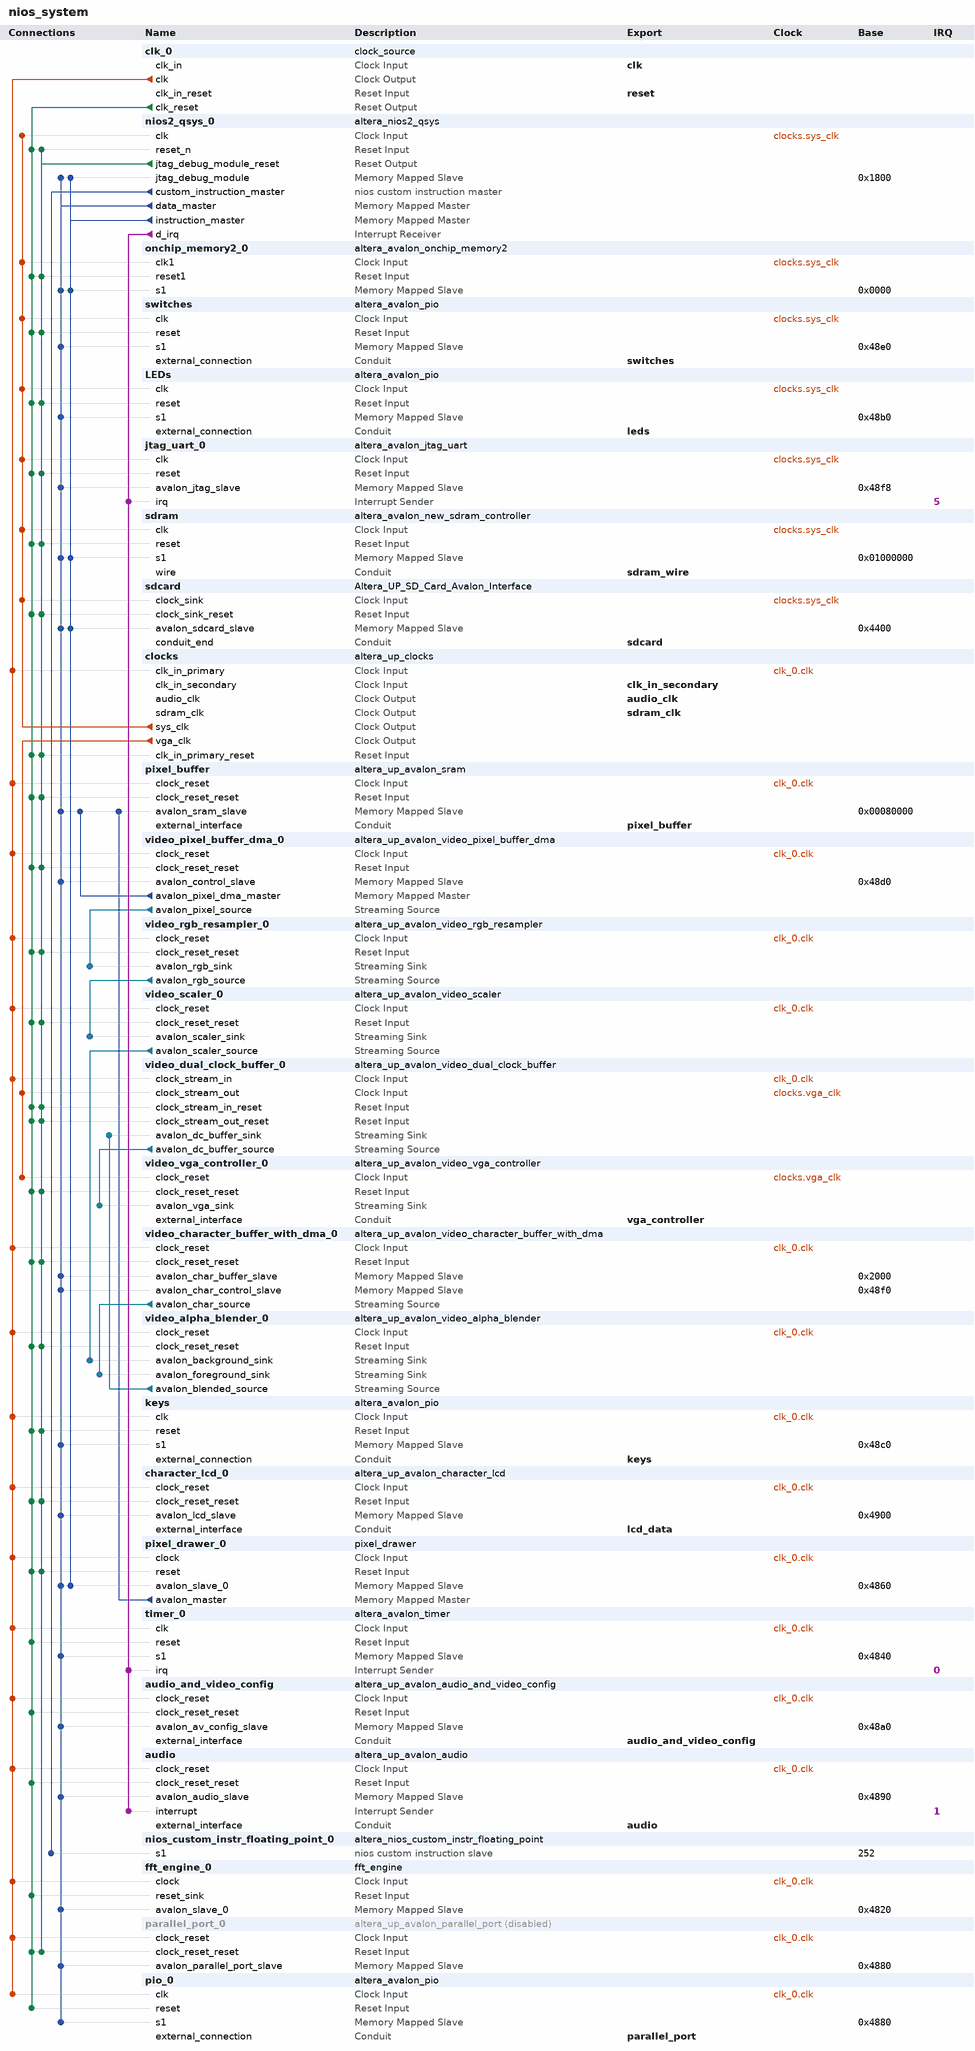
[diagram p0: system contents]
# Platform Designer (Qsys) system nios_system, Cyclone II EP2C35F672C6
# Parameters at their usual value, and those the tool derives, are not listed.
package require -exact qsys 13.0
create_system nios_system
set_project_property DEVICE_FAMILY {Cyclone II}
set_project_property DEVICE EP2C35F672C6

add_instance clk_0 clock_source 13.0
set_instance_parameter_value clk_0 clockFrequency 50000000

add_instance nios2_qsys_0 altera_nios2_qsys 13.0
set_instance_parameter_value nios2_qsys_0 muldiv_divider true
set_instance_parameter_value nios2_qsys_0 resetSlave sdram.s1
set_instance_parameter_value nios2_qsys_0 mmu_TLBMissExcSlave None
set_instance_parameter_value nios2_qsys_0 exceptionSlave sdram.s1
set_instance_parameter_value nios2_qsys_0 breakSlave nios2_qsys_0.jtag_debug_module
set_instance_parameter_value nios2_qsys_0 impl Fast
set_instance_parameter_value nios2_qsys_0 icache_size 4096

add_instance onchip_memory2_0 altera_avalon_onchip_memory2 13.0.1.99.2
set_instance_parameter_value onchip_memory2_0 dataWidth 32
set_instance_parameter_value onchip_memory2_0 dualPort false
set_instance_parameter_value onchip_memory2_0 initMemContent true
set_instance_parameter_value onchip_memory2_0 initializationFileName onchip_mem.hex
set_instance_parameter_value onchip_memory2_0 memorySize 4096

add_instance switches altera_avalon_pio 13.0.1.99.2
set_instance_parameter_value switches direction Input
set_instance_parameter_value switches width 15

add_instance LEDs altera_avalon_pio 13.0.1.99.2
set_instance_parameter_value LEDs direction Output
set_instance_parameter_value LEDs width 8

add_instance jtag_uart_0 altera_avalon_jtag_uart 13.0.1.99.2
set_instance_parameter_value jtag_uart_0 simInteractiveOptions NO_INTERACTIVE_WINDOWS

add_instance sdram altera_avalon_new_sdram_controller 13.0.1.99.2
set_instance_parameter_value sdram TAC 5.5
set_instance_parameter_value sdram TRCD 20.0
set_instance_parameter_value sdram TRP 20.0
set_instance_parameter_value sdram casLatency 3
set_instance_parameter_value sdram columnWidth 8
set_instance_parameter_value sdram dataWidth 16
set_instance_parameter_value sdram generateSimulationModel false
set_instance_parameter_value sdram model single_Micron_MT48LC4M32B2_7_chip
set_instance_parameter_value sdram numberOfBanks 4
set_instance_parameter_value sdram numberOfChipSelects 1
set_instance_parameter_value sdram powerUpDelay 100.0
set_instance_parameter_value sdram refreshPeriod 15.625
set_instance_parameter_value sdram rowWidth 12

add_instance sdcard Altera_UP_SD_Card_Avalon_Interface 13.0

add_instance clocks altera_up_clocks 13.0
set_instance_parameter_value clocks board DE2
set_instance_parameter_value clocks vga_clk true
set_instance_parameter_value clocks audio_clk true
set_instance_parameter_value clocks audio_clk_freq 12.288

add_instance pixel_buffer altera_up_avalon_sram 13.0
set_instance_parameter_value pixel_buffer board DE2
set_instance_parameter_value pixel_buffer pixel_buffer true

add_instance video_pixel_buffer_dma_0 altera_up_avalon_video_pixel_buffer_dma 13.0
set_instance_parameter_value video_pixel_buffer_dma_0 addr_mode X-Y
set_instance_parameter_value video_pixel_buffer_dma_0 start_address 0
set_instance_parameter_value video_pixel_buffer_dma_0 back_start_address 0
set_instance_parameter_value video_pixel_buffer_dma_0 image_width 320
set_instance_parameter_value video_pixel_buffer_dma_0 image_height 240
set_instance_parameter_value video_pixel_buffer_dma_0 color_space {16-bit RGB}

add_instance video_rgb_resampler_0 altera_up_avalon_video_rgb_resampler 13.0
set_instance_parameter_value video_rgb_resampler_0 input_type {16-bit RGB}
set_instance_parameter_value video_rgb_resampler_0 output_type {30-bit RGB}
set_instance_parameter_value video_rgb_resampler_0 alpha 1023

add_instance video_scaler_0 altera_up_avalon_video_scaler 13.0
set_instance_parameter_value video_scaler_0 width_scaling 2
set_instance_parameter_value video_scaler_0 height_scaling 2
set_instance_parameter_value video_scaler_0 width_in 320
set_instance_parameter_value video_scaler_0 color_bits 10
set_instance_parameter_value video_scaler_0 color_planes 3

add_instance video_dual_clock_buffer_0 altera_up_avalon_video_dual_clock_buffer 13.0
set_instance_parameter_value video_dual_clock_buffer_0 color_bits 10

add_instance video_vga_controller_0 altera_up_avalon_video_vga_controller 13.0
set_instance_parameter_value video_vga_controller_0 board DE2

add_instance video_character_buffer_with_dma_0 altera_up_avalon_video_character_buffer_with_dma 13.0
set_instance_parameter_value video_character_buffer_with_dma_0 enable_transparency true

add_instance video_alpha_blender_0 altera_up_avalon_video_alpha_blender 13.0

add_instance keys altera_avalon_pio 13.0.1.99.2
set_instance_parameter_value keys direction Input
set_instance_parameter_value keys width 3

add_instance character_lcd_0 altera_up_avalon_character_lcd 13.0
set_instance_parameter_value character_lcd_0 cursor Normal

add_instance pixel_drawer_0 pixel_drawer 1.0
set_instance_parameter_value pixel_drawer_0 pixel_buffer_base 524288

add_instance timer_0 altera_avalon_timer 13.0.1.99.2
set_instance_parameter_value timer_0 period 1
set_instance_parameter_value timer_0 periodUnits MSEC

add_instance audio_and_video_config altera_up_avalon_audio_and_video_config 13.0
set_instance_parameter_value audio_and_video_config board DE2
set_instance_parameter_value audio_and_video_config audio_in {Microphone to ADC}
set_instance_parameter_value audio_and_video_config line_in_bypass false
set_instance_parameter_value audio_and_video_config bit_length 16
set_instance_parameter_value audio_and_video_config sampling_rate {32 kHz}

add_instance audio altera_up_avalon_audio 13.0
set_instance_parameter_value audio avalon_bus_type {Memory Mapped}
set_instance_parameter_value audio audio_in true
set_instance_parameter_value audio dw 16

add_instance nios_custom_instr_floating_point_0 altera_nios_custom_instr_floating_point 13.0

add_instance fft_engine_0 fft_engine 1.0

add_instance parallel_port_0 altera_up_avalon_parallel_port 13.0
set_instance_property parallel_port_0 ENABLED false
set_instance_parameter_value parallel_port_0 board DE2
set_instance_parameter_value parallel_port_0 preset {Expansion Header}
set_instance_parameter_value parallel_port_0 capture false
set_instance_parameter_value parallel_port_0 edge Rising
set_instance_parameter_value parallel_port_0 irq false

add_instance pio_0 altera_avalon_pio 13.0.1.99.2
set_instance_parameter_value pio_0 direction Bidir
set_instance_parameter_value pio_0 width 15

# connections
add_connection clk_0.clk audio.clock_reset clock
add_connection clk_0.clk audio_and_video_config.clock_reset clock
add_connection clk_0.clk character_lcd_0.clock_reset clock
add_connection clk_0.clk clocks.clk_in_primary clock
add_connection clk_0.clk fft_engine_0.clock clock
add_connection clk_0.clk keys.clk clock
add_connection clk_0.clk parallel_port_0.clock_reset clock
add_connection clk_0.clk pio_0.clk clock
add_connection clk_0.clk pixel_buffer.clock_reset clock
add_connection clk_0.clk pixel_drawer_0.clock clock
add_connection clk_0.clk timer_0.clk clock
add_connection clk_0.clk video_alpha_blender_0.clock_reset clock
add_connection clk_0.clk video_character_buffer_with_dma_0.clock_reset clock
add_connection clk_0.clk video_dual_clock_buffer_0.clock_stream_in clock
add_connection clk_0.clk video_pixel_buffer_dma_0.clock_reset clock
add_connection clk_0.clk video_rgb_resampler_0.clock_reset clock
add_connection clk_0.clk video_scaler_0.clock_reset clock
add_connection clocks.sys_clk jtag_uart_0.clk clock
add_connection clocks.sys_clk LEDs.clk clock
add_connection clocks.sys_clk nios2_qsys_0.clk clock
add_connection clocks.sys_clk onchip_memory2_0.clk1 clock
add_connection clocks.sys_clk sdcard.clock_sink clock
add_connection clocks.sys_clk sdram.clk clock
add_connection clocks.sys_clk switches.clk clock
add_connection clocks.vga_clk video_dual_clock_buffer_0.clock_stream_out clock
add_connection clocks.vga_clk video_vga_controller_0.clock_reset clock
add_connection clk_0.clk_reset audio.clock_reset_reset reset
add_connection clk_0.clk_reset audio_and_video_config.clock_reset_reset reset
add_connection clk_0.clk_reset character_lcd_0.clock_reset_reset reset
add_connection clk_0.clk_reset clocks.clk_in_primary_reset reset
add_connection clk_0.clk_reset fft_engine_0.reset_sink reset
add_connection clk_0.clk_reset jtag_uart_0.reset reset
add_connection clk_0.clk_reset keys.reset reset
add_connection clk_0.clk_reset LEDs.reset reset
add_connection clk_0.clk_reset nios2_qsys_0.reset_n reset
add_connection clk_0.clk_reset onchip_memory2_0.reset1 reset
add_connection clk_0.clk_reset parallel_port_0.clock_reset_reset reset
add_connection clk_0.clk_reset pio_0.reset reset
add_connection clk_0.clk_reset pixel_buffer.clock_reset_reset reset
add_connection clk_0.clk_reset pixel_drawer_0.reset reset
add_connection clk_0.clk_reset sdcard.clock_sink_reset reset
add_connection clk_0.clk_reset sdram.reset reset
add_connection clk_0.clk_reset switches.reset reset
add_connection clk_0.clk_reset timer_0.reset reset
add_connection clk_0.clk_reset video_alpha_blender_0.clock_reset_reset reset
add_connection clk_0.clk_reset video_character_buffer_with_dma_0.clock_reset_reset reset
add_connection clk_0.clk_reset video_dual_clock_buffer_0.clock_stream_in_reset reset
add_connection clk_0.clk_reset video_dual_clock_buffer_0.clock_stream_out_reset reset
add_connection clk_0.clk_reset video_pixel_buffer_dma_0.clock_reset_reset reset
add_connection clk_0.clk_reset video_rgb_resampler_0.clock_reset_reset reset
add_connection clk_0.clk_reset video_scaler_0.clock_reset_reset reset
add_connection clk_0.clk_reset video_vga_controller_0.clock_reset_reset reset
add_connection nios2_qsys_0.jtag_debug_module_reset character_lcd_0.clock_reset_reset reset
add_connection nios2_qsys_0.jtag_debug_module_reset clocks.clk_in_primary_reset reset
add_connection nios2_qsys_0.jtag_debug_module_reset jtag_uart_0.reset reset
add_connection nios2_qsys_0.jtag_debug_module_reset keys.reset reset
add_connection nios2_qsys_0.jtag_debug_module_reset LEDs.reset reset
add_connection nios2_qsys_0.jtag_debug_module_reset nios2_qsys_0.reset_n reset
add_connection nios2_qsys_0.jtag_debug_module_reset onchip_memory2_0.reset1 reset
add_connection nios2_qsys_0.jtag_debug_module_reset parallel_port_0.clock_reset_reset reset
add_connection nios2_qsys_0.jtag_debug_module_reset pixel_buffer.clock_reset_reset reset
add_connection nios2_qsys_0.jtag_debug_module_reset pixel_drawer_0.reset reset
add_connection nios2_qsys_0.jtag_debug_module_reset sdcard.clock_sink_reset reset
add_connection nios2_qsys_0.jtag_debug_module_reset sdram.reset reset
add_connection nios2_qsys_0.jtag_debug_module_reset switches.reset reset
add_connection nios2_qsys_0.jtag_debug_module_reset video_alpha_blender_0.clock_reset_reset reset
add_connection nios2_qsys_0.jtag_debug_module_reset video_character_buffer_with_dma_0.clock_reset_reset reset
add_connection nios2_qsys_0.jtag_debug_module_reset video_dual_clock_buffer_0.clock_stream_in_reset reset
add_connection nios2_qsys_0.jtag_debug_module_reset video_dual_clock_buffer_0.clock_stream_out_reset reset
add_connection nios2_qsys_0.jtag_debug_module_reset video_pixel_buffer_dma_0.clock_reset_reset reset
add_connection nios2_qsys_0.jtag_debug_module_reset video_rgb_resampler_0.clock_reset_reset reset
add_connection nios2_qsys_0.jtag_debug_module_reset video_scaler_0.clock_reset_reset reset
add_connection nios2_qsys_0.jtag_debug_module_reset video_vga_controller_0.clock_reset_reset reset
add_connection nios2_qsys_0.data_master audio.avalon_audio_slave avalon
set_connection_parameter_value nios2_qsys_0.data_master/audio.avalon_audio_slave baseAddress 0x4890
add_connection nios2_qsys_0.data_master audio_and_video_config.avalon_av_config_slave avalon
set_connection_parameter_value nios2_qsys_0.data_master/audio_and_video_config.avalon_av_config_slave baseAddress 0x48a0
add_connection nios2_qsys_0.data_master character_lcd_0.avalon_lcd_slave avalon
set_connection_parameter_value nios2_qsys_0.data_master/character_lcd_0.avalon_lcd_slave baseAddress 0x4900
add_connection nios2_qsys_0.data_master fft_engine_0.avalon_slave_0 avalon
set_connection_parameter_value nios2_qsys_0.data_master/fft_engine_0.avalon_slave_0 baseAddress 0x4820
add_connection nios2_qsys_0.data_master jtag_uart_0.avalon_jtag_slave avalon
set_connection_parameter_value nios2_qsys_0.data_master/jtag_uart_0.avalon_jtag_slave baseAddress 0x48f8
add_connection nios2_qsys_0.data_master keys.s1 avalon
set_connection_parameter_value nios2_qsys_0.data_master/keys.s1 baseAddress 0x48c0
add_connection nios2_qsys_0.data_master LEDs.s1 avalon
set_connection_parameter_value nios2_qsys_0.data_master/LEDs.s1 baseAddress 0x48b0
add_connection nios2_qsys_0.data_master nios2_qsys_0.jtag_debug_module avalon
set_connection_parameter_value nios2_qsys_0.data_master/nios2_qsys_0.jtag_debug_module baseAddress 0x1800
add_connection nios2_qsys_0.data_master onchip_memory2_0.s1 avalon
set_connection_parameter_value nios2_qsys_0.data_master/onchip_memory2_0.s1 baseAddress 0x0000
add_connection nios2_qsys_0.data_master parallel_port_0.avalon_parallel_port_slave avalon
set_connection_parameter_value nios2_qsys_0.data_master/parallel_port_0.avalon_parallel_port_slave baseAddress 0x4880
add_connection nios2_qsys_0.data_master pio_0.s1 avalon
set_connection_parameter_value nios2_qsys_0.data_master/pio_0.s1 baseAddress 0x4880
add_connection nios2_qsys_0.data_master pixel_buffer.avalon_sram_slave avalon
set_connection_parameter_value nios2_qsys_0.data_master/pixel_buffer.avalon_sram_slave baseAddress 0x00080000
add_connection nios2_qsys_0.data_master pixel_drawer_0.avalon_slave_0 avalon
set_connection_parameter_value nios2_qsys_0.data_master/pixel_drawer_0.avalon_slave_0 baseAddress 0x4860
add_connection nios2_qsys_0.data_master sdcard.avalon_sdcard_slave avalon
set_connection_parameter_value nios2_qsys_0.data_master/sdcard.avalon_sdcard_slave baseAddress 0x4400
add_connection nios2_qsys_0.data_master sdram.s1 avalon
set_connection_parameter_value nios2_qsys_0.data_master/sdram.s1 baseAddress 0x01000000
add_connection nios2_qsys_0.data_master switches.s1 avalon
set_connection_parameter_value nios2_qsys_0.data_master/switches.s1 baseAddress 0x48e0
add_connection nios2_qsys_0.data_master timer_0.s1 avalon
set_connection_parameter_value nios2_qsys_0.data_master/timer_0.s1 baseAddress 0x4840
add_connection nios2_qsys_0.data_master video_character_buffer_with_dma_0.avalon_char_buffer_slave avalon
set_connection_parameter_value nios2_qsys_0.data_master/video_character_buffer_with_dma_0.avalon_char_buffer_slave baseAddress 0x2000
add_connection nios2_qsys_0.data_master video_character_buffer_with_dma_0.avalon_char_control_slave avalon
set_connection_parameter_value nios2_qsys_0.data_master/video_character_buffer_with_dma_0.avalon_char_control_slave baseAddress 0x48f0
add_connection nios2_qsys_0.data_master video_pixel_buffer_dma_0.avalon_control_slave avalon
set_connection_parameter_value nios2_qsys_0.data_master/video_pixel_buffer_dma_0.avalon_control_slave baseAddress 0x48d0
add_connection nios2_qsys_0.instruction_master nios2_qsys_0.jtag_debug_module avalon
set_connection_parameter_value nios2_qsys_0.instruction_master/nios2_qsys_0.jtag_debug_module baseAddress 0x1800
add_connection nios2_qsys_0.instruction_master onchip_memory2_0.s1 avalon
set_connection_parameter_value nios2_qsys_0.instruction_master/onchip_memory2_0.s1 baseAddress 0x0000
add_connection nios2_qsys_0.instruction_master pixel_drawer_0.avalon_slave_0 avalon
set_connection_parameter_value nios2_qsys_0.instruction_master/pixel_drawer_0.avalon_slave_0 baseAddress 0x4860
add_connection nios2_qsys_0.instruction_master sdcard.avalon_sdcard_slave avalon
set_connection_parameter_value nios2_qsys_0.instruction_master/sdcard.avalon_sdcard_slave baseAddress 0x4400
add_connection nios2_qsys_0.instruction_master sdram.s1 avalon
set_connection_parameter_value nios2_qsys_0.instruction_master/sdram.s1 baseAddress 0x01000000
add_connection pixel_drawer_0.avalon_master pixel_buffer.avalon_sram_slave avalon
set_connection_parameter_value pixel_drawer_0.avalon_master/pixel_buffer.avalon_sram_slave baseAddress 0x00080000
add_connection video_pixel_buffer_dma_0.avalon_pixel_dma_master pixel_buffer.avalon_sram_slave avalon
set_connection_parameter_value video_pixel_buffer_dma_0.avalon_pixel_dma_master/pixel_buffer.avalon_sram_slave baseAddress 0x00080000
add_connection video_alpha_blender_0.avalon_blended_source video_dual_clock_buffer_0.avalon_dc_buffer_sink avalon_streaming
add_connection video_character_buffer_with_dma_0.avalon_char_source video_alpha_blender_0.avalon_foreground_sink avalon_streaming
add_connection video_dual_clock_buffer_0.avalon_dc_buffer_source video_vga_controller_0.avalon_vga_sink avalon_streaming
add_connection video_pixel_buffer_dma_0.avalon_pixel_source video_rgb_resampler_0.avalon_rgb_sink avalon_streaming
add_connection video_rgb_resampler_0.avalon_rgb_source video_scaler_0.avalon_scaler_sink avalon_streaming
add_connection video_scaler_0.avalon_scaler_source video_alpha_blender_0.avalon_background_sink avalon_streaming
add_connection nios2_qsys_0.d_irq audio.interrupt interrupt
set_connection_parameter_value nios2_qsys_0.d_irq/audio.interrupt irqNumber 1
add_connection nios2_qsys_0.d_irq jtag_uart_0.irq interrupt
set_connection_parameter_value nios2_qsys_0.d_irq/jtag_uart_0.irq irqNumber 5
add_connection nios2_qsys_0.d_irq timer_0.irq interrupt
set_connection_parameter_value nios2_qsys_0.d_irq/timer_0.irq irqNumber 0
add_connection nios2_qsys_0.custom_instruction_master nios_custom_instr_floating_point_0.s1 nios_custom_instruction
set_connection_parameter_value nios2_qsys_0.custom_instruction_master/nios_custom_instr_floating_point_0.s1 CIName nios_custom_instr_floating_point_0
set_connection_parameter_value nios2_qsys_0.custom_instruction_master/nios_custom_instr_floating_point_0.s1 baseAddress 252

# exported interfaces
add_interface clk clock sink
set_interface_property clk EXPORT_OF clk_0.clk_in
add_interface reset reset sink
set_interface_property reset EXPORT_OF clk_0.clk_in_reset
add_interface switches conduit end
set_interface_property switches EXPORT_OF switches.external_connection
add_interface leds conduit end
set_interface_property leds EXPORT_OF LEDs.external_connection
add_interface sdram_wire conduit end
set_interface_property sdram_wire EXPORT_OF sdram.wire
add_interface sdram_clk clock source
set_interface_property sdram_clk EXPORT_OF clocks.sdram_clk
add_interface sdcard conduit end
set_interface_property sdcard EXPORT_OF sdcard.conduit_end
add_interface pixel_buffer conduit end
set_interface_property pixel_buffer EXPORT_OF pixel_buffer.external_interface
add_interface vga_controller conduit end
set_interface_property vga_controller EXPORT_OF video_vga_controller_0.external_interface
add_interface keys conduit end
set_interface_property keys EXPORT_OF keys.external_connection
add_interface lcd_data conduit end
set_interface_property lcd_data EXPORT_OF character_lcd_0.external_interface
add_interface audio_and_video_config conduit end
set_interface_property audio_and_video_config EXPORT_OF audio_and_video_config.external_interface
add_interface audio_clk clock source
set_interface_property audio_clk EXPORT_OF clocks.audio_clk
add_interface clk_in_secondary clock sink
set_interface_property clk_in_secondary EXPORT_OF clocks.clk_in_secondary
add_interface audio conduit end
set_interface_property audio EXPORT_OF audio.external_interface
add_interface parallel_port conduit end
set_interface_property parallel_port EXPORT_OF pio_0.external_connection

set_interconnect_requirement {$system} qsys_mm.clockCrossingAdapter HANDSHAKE
set_interconnect_requirement {$system} qsys_mm.maxAdditionalLatency 1

save_system nios_system.qsys
